# Altium schematic sheet cree_module (ye-sheng kuo's conflicted copy 2014-07-03).SchDoc
size Letter
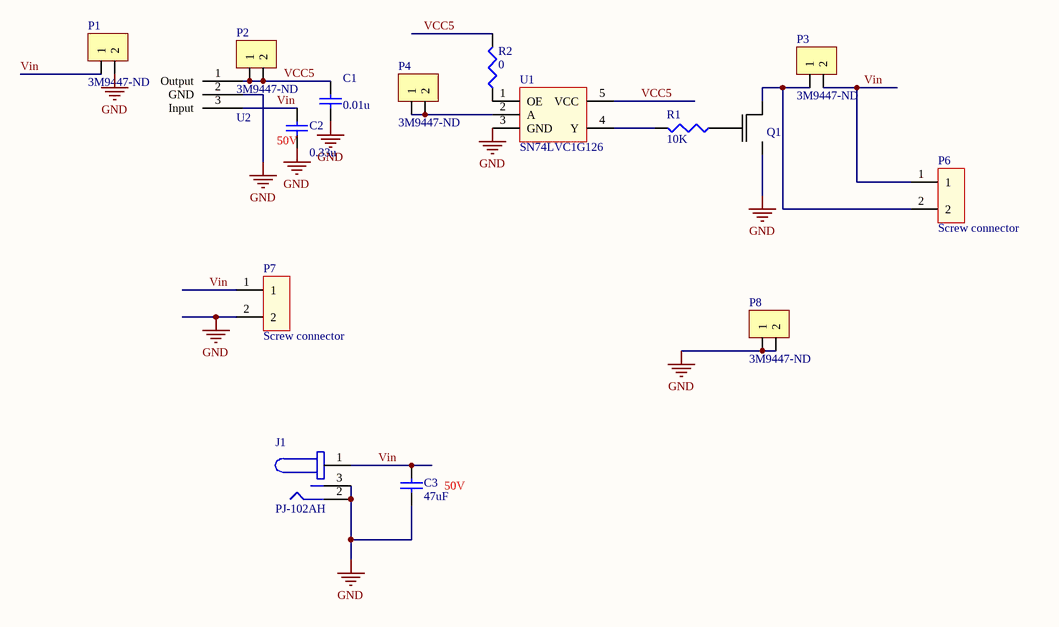
[diagram p0: cree_module (ye-sheng kuo's conflicted copy 2014-07-03).SchDoc]

## Parts
C1  value 0.01u  [1608[0603]]  (hidden comment: Cap Semi)
C2  value 0.33u  [1608[0603]]  (hidden comment: Cap Semi)
C3  value 47uF  [C1210]  (hidden comment: Cap Semi)
J1  PJ-102AH  [PJ-102AH]
P1  Supplier Part Number 1: 3M9447-ND  [1x2 header]  (hidden comment: 1 x 2 header)
P2  Supplier Part Number 1: 3M9447-ND  [1x2 header]  (hidden comment: 1 x 2 header)
P3  Supplier Part Number 1: 3M9447-ND  [1x2 header]  (hidden comment: 1 x 2 header)
P4  Supplier Part Number 1: 3M9447-ND  [1x2 header]  (hidden comment: 1 x 2 header)
P6  Screw connector  [MPT_2position]
P7  Screw connector  [MPT_2position]
P8  Supplier Part Number 1: 3M9447-ND  [1x2 header]  (hidden comment: 1 x 2 header)
Q1  Si2312CDS  [SOT95P250-3N]  (value not drawn)
R1  value 10K  [J1-0603]  (hidden comment: Res3)
R2  value 0  [J1-0603]  (hidden comment: Res3)
U1  SN74LVC1G126  [SOT23-5]
U2  LM78L05  [TO92]  (value not drawn)

## Nets
GND: C1.1 C2.1 C3.1 J1.2 J1.3 P1.2 P7.2 P8.1 P8.2 Q1.2(S) U1.3(GND) U2.2(GND)
VCC5: C1.2 P2.1 P2.2 R2.2 U1.5(VCC) U2.1(Output)
Vin: C2.2 C3.2 J1.1 P1.1 P3.2 P6.1 P7.1 U2.3(Input)
NetP3_1: P3.1 P6.2 Q1.3(D)
NetP4_1: P4.1 P4.2 U1.2(A)
NetQ1_1: Q1.1(G) R1.1
NetR1_2: R1.2 U1.4(Y)
NetR2_1: R2.1 U1.1(OE)

## Notes on the sheet
- (near C2) 50V
- (near C3) 50V
- Title
- Date:
- Author:
- Revision:
- Sheet
- of
- University of Michigan
- File:

## Library data of the parts
C1-C3 = Cap Semi: Capacitor (Semiconductor SIM Model); Published: 8-Jun-2000; LatestRevisionDate: 29-May-2009; LatestRevisionNote: IPC-7351 Footprint Added.; PackageReference: C1206; Publisher: Altium Limited; PackageDescription: Chip Capacitor
J1 = PJ-102AH: CONN PWR JACK 2.1X5.5MM HIGH CUR; Supplier 1: Digi-Key; Supplier Part Number 1: CP-102AH-ND
P1-P4 P8 = 1 x 2 header: 100 mils standard header; Supplier 1: Digi-Key
P6 P7 = MPT_2POS: Screw connector 2 positions; Supplier 1: Digi-Key; Supplier Part Number 1: 277-1273-ND
Q1 = Si2312CDS: N-Channel 20 V (D-S) MOSFET; Supplier 1: Digi-Key; Supplier Part Number 1: SI2312CDS-T1-GE3DKR-ND
R1 R2 = Res3: Resistor; Published: 8-Jun-2000; LatestRevisionDate: 29-May-2009; LatestRevisionNote: IPC-7351 Footprint Added.; PackageReference: J1-0603; Publisher: Altium Limited; PackageDescription: Chip Resistor
U1 = SN74LVC1G126: Single Bus Buffer Gate With 3-State Output; Supplier 1: Digi-Key; Supplier Part Number 1: 296-11605-1-ND
U2 = LM78L05: LM78LXX Series 3-Terminal Positive Regulators; Supplier 1: Digi-Key; Supplier Part Number 1: LM78L05ACZNS/NOPB-ND